# EAGLE design PC-DC_Board (EAGLE 6.6.0)
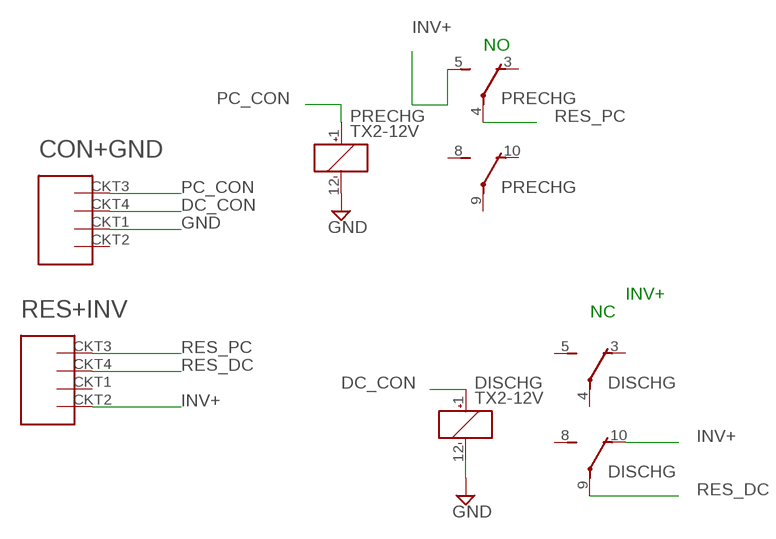
[diagram p0: schematic, sheet 1]

## Parts
CON+GND  MHYBRIDMOLEX  [MOLEXMINIFIT6]
DISCHG  TX2-12V  [TX2]
PRECHG  TX2-12V  [TX2]
RES+INV  MHYBRIDMOLEX  [MOLEXMINIFIT6]

## Nets
DC_CON: CON+GND.CKT4(V_IN2(12)) DISCHG.1(_:+)
GND: CON+GND.CKT1(GND) DISCHG.12(_:-) PRECHG.12(_:-)
INV+: DISCHG.10(2:O) PRECHG.5(1:S) RES+INV.CKT2(GND2)
PC_CON: CON+GND.CKT3(V_IN(12)) PRECHG.1(_:+)
RES_DC: DISCHG.9(2:P) RES+INV.CKT4(V_IN2(12))
RES_PC: PRECHG.4(1:P) RES+INV.CKT3(V_IN(12))
Unconnected: CON+GND.CKT2(GND2) DISCHG.3(1:O) DISCHG.4(1:P) DISCHG.5(1:S) DISCHG.8(2:S) PRECHG.3(1:O) PRECHG.8(2:S) PRECHG.9(2:P) PRECHG.10(2:O) RES+INV.CKT1(GND)

## Notes on the sheet
- NO
- INV+
- NC

## Library data of the parts
CON+GND RES+INV = mhybrid molex megaFit:MHYBRIDMOLEX
DISCHG PRECHG = relay:TX2?-*: 2 AMP. HIGH CAPACITY RELAY NAiS WITH HIGH SURGE VOLTAGE & HIGH BREAKDOWN VOLTAGE Source: http://www.mew-europe.com/.. en_ds_61022_0001.pdf; MF: AROMAT/ MATSUSHITA; MPN: TX2-12V; OC_FARNELL: 1200952; OC_NEWARK: 67K1295

## Board
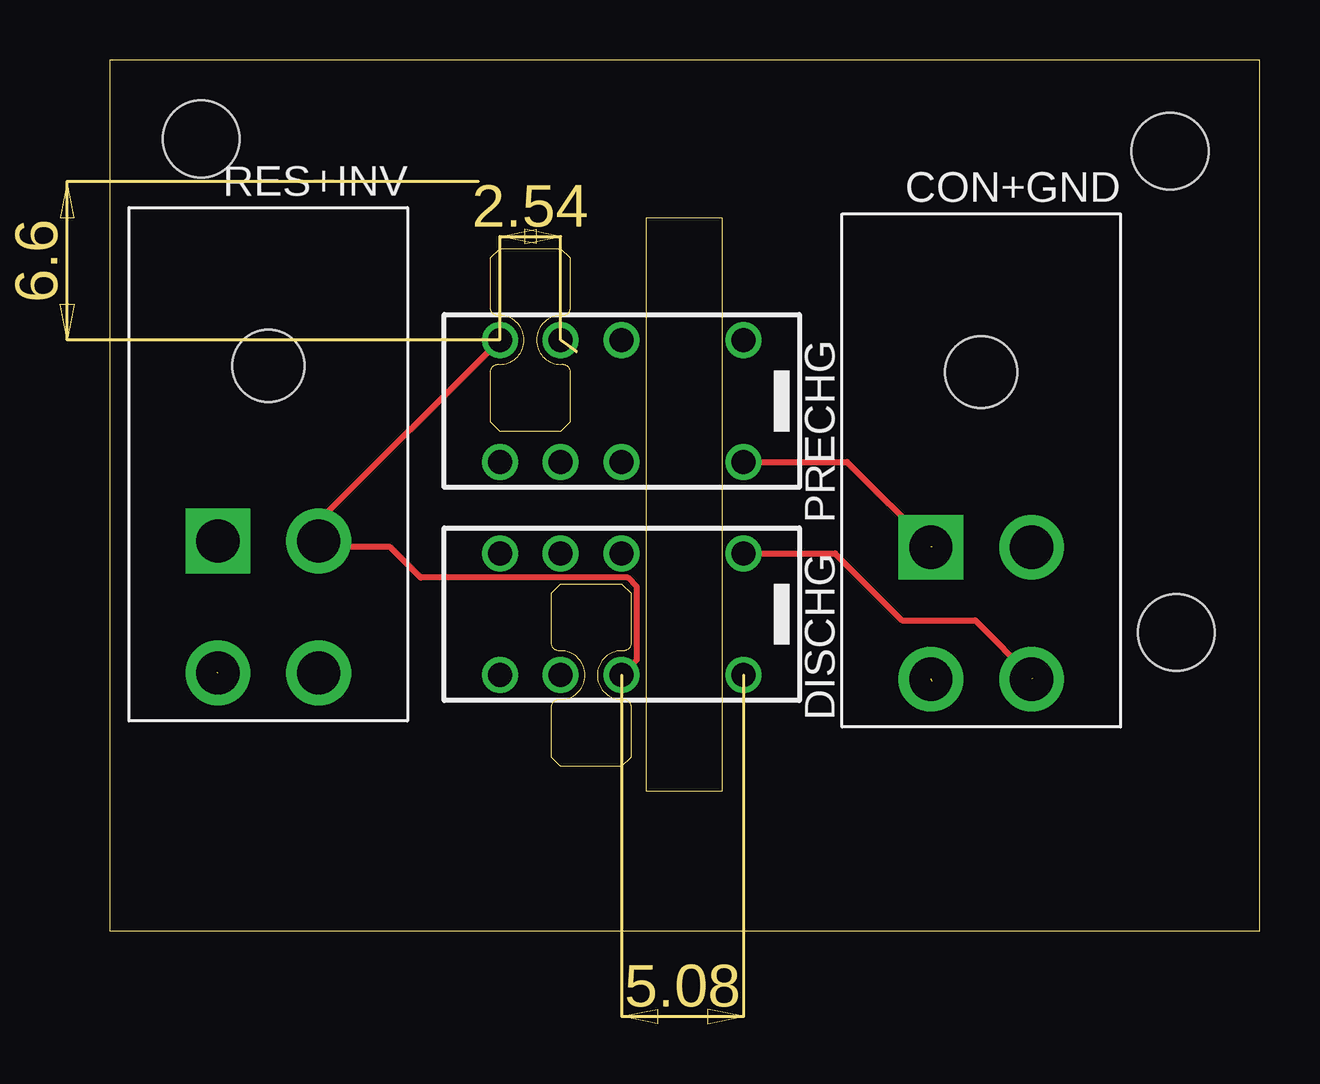
[diagram p1: board, top side]
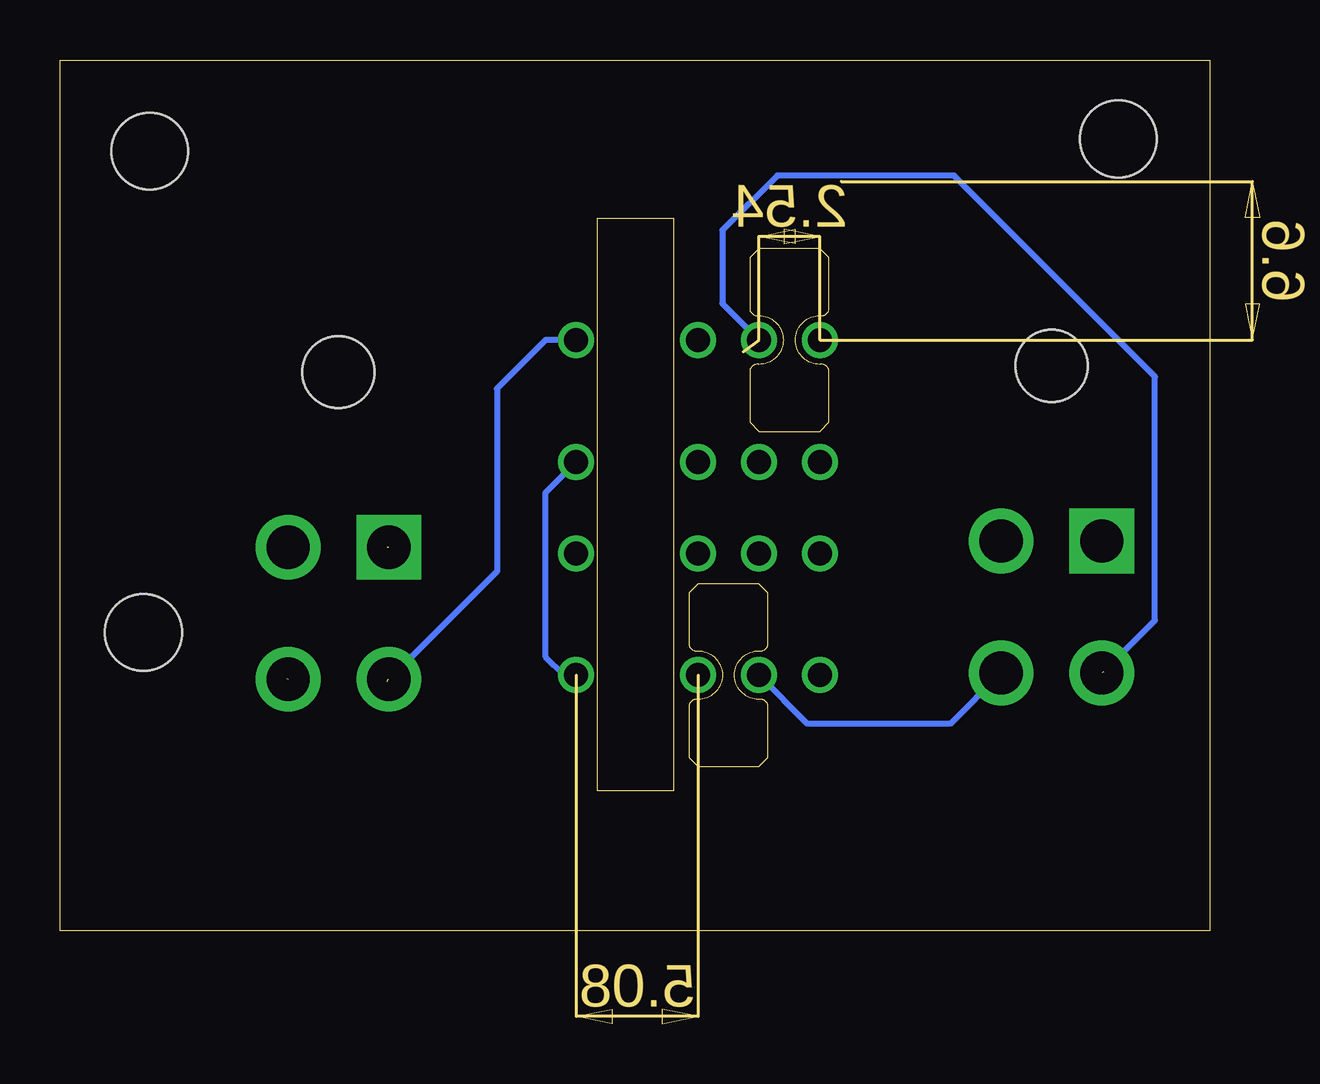
[diagram p2: board, bottom side, seen from below]

Size 47.93 x 36.31 mm. Coordinates in mm from the lower left corner, seen from the top.
Outline: 0,0 47.93,0 47.93,36.31 0,36.31 0,0
Copper layers (1*16): Top 0.0356mm / dielectric 1.5011mm / Bottom 0.0356mm
Design rules "LaenPCBOrder": minimum track width 6mil, minimum drill 13mil, track to track 6mil, track to pad 6mil, pad to pad 6mil, via to via 6mil, smd to smd 6mil, copper to edge 15mil, drill to drill 6mil, minimum pad ring 7mil, minimum via ring 7mil, stop-mask expansion 3mil, vias tented up to drill 0mil, thermal gap 10mil
Holes 3.2 mm at 3.81,33.02 44.2,32.51 44.45,12.45

### Footprints (pad centres in the part's own frame; a part is rotated, then mirrored left to right if it is on the bottom)
MOLEXMINIFIT6 = drill 1.8 square: CKT1 2.1,0 | drill 1.8: CKT2 -2.1,0; CKT3 2.1,5.5; CKT4 -2.1,5.5 | hole 3: 0,-7.3
TX2 = drill 1: 1 -5.08,-2.54; 3 0,-2.54; 4 2.54,-2.54; 5 5.08,-2.54; 8 5.08,2.54; 9 2.54,2.54; 10 0,2.54; 12 -5.08,2.54

### Placement (x,y rotation side)
CON+GND  36.32,16 180 top
DISCHG  21.34,13.21 180 top
PRECHG  21.34,22.1 180 top
RES+INV  6.6,16.26 180 top

### Tracks (layer width: path | path; a pad name or v marks a point on that pad's centre or on a via)
DC_CON  (1 unrouted)
  Top 0.254: DISCHG.1 30.23,15.75 33.02,12.95 36.07,12.95 38.48,10.54
GND  (1 unrouted)
  Top 0.254: PRECHG.12 30.73,19.56 34.29,16
  Bottom 0.254: DISCHG.12 26.92,10.67 27.69,11.43 27.69,18.29 PRECHG.12
INV+
  Top 0.254: PRECHG.5 8.7,17.09 RES+INV.CKT2 8.96,16 11.68,16 12.95,14.73 21.59,14.73 21.97,14.35 21.97,11.3 DISCHG.10
PC_CON  (1 unrouted)
  Bottom 0.254: PRECHG.1 27.69,24.64 29.72,22.61 29.72,14.99 34.29,10.41
RES_DC
  Bottom 0.254: RES+INV.CKT4 10.82,8.64 16.76,8.64 DISCHG.9
RES_PC  (via drill 0.6)  (1 unrouted)
  Top 0.254: 4.57,10.79 v4.45,10.79
  Bottom 0.254: v4.45,10.79 2.29,12.95 2.29,23.11 10.67,31.5 18.03,31.5 20.32,29.21 20.32,26.16 PRECHG.4